# Altium schematic sheet EntradasAnalogicas.SchDoc
size A4; SheetNumber: 6; SheetTotal: 10
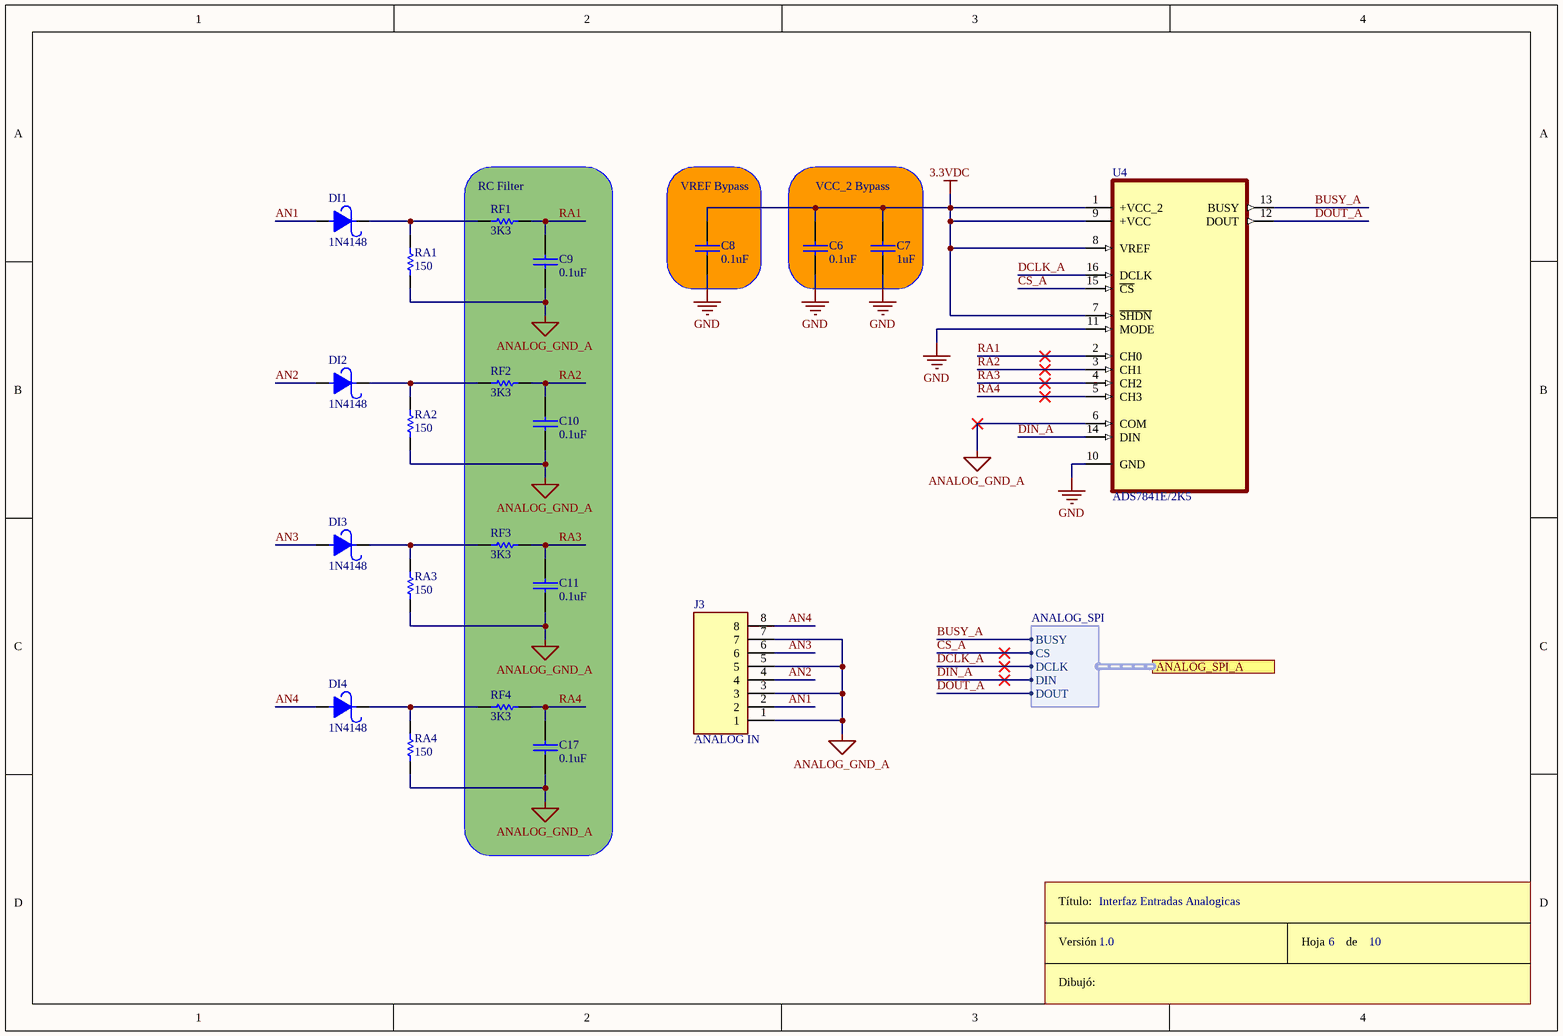
[diagram p0: EntradasAnalogicas.SchDoc]

## Parts
C6  0.1uF  [CAP100]
C7  1uF  [CAP200]
C8  0.1uF  [CAP100]
C9  0.1uF  [CAP100]
C10  0.1uF  [CAP100]
C11  0.1uF  [CAP100]
C17  0.1uF  [CAP100]
DI1  1N4148  [DO41]
DI2  1N4148  [DO41]
DI3  1N4148  [DO41]
DI4  1N4148  [DO41]
J3  ANALOG IN  [TE_1586863-8]
RA1  150  [RES300]
RA2  150  [RES300]
RA3  150  [RES300]
RA4  150  [RES300]
RF1  3K3  [RES300]
RF2  3K3  [RES300]
RF3  3K3  [RES300]
RF4  3K3  [RES300]
ROT4  Rótulo  (value not drawn)  (graphical)
U4  ADS7841E/2K5  [SOP63P600X175-16N]

## Blocks framed on the sheet
RC Filter: C9-C11 C17 RF1-RF4
VREF Bypass: C8
VCC_2 Bypass: C6 C7

## Ports
ANALOG_SPI_A (harness ANALOG_SPI)

## Harnesses
ANALOG_SPI: BUSY, CS, DCLK, DIN, DOUT

## Nets
3.3VDC: C6.1 C7.1 C8.1 U4.1(+VCC_2) U4.7(~{SHDN}) U4.8(VREF) U4.9(+VCC)
ANALOG_GND_A: C9.2 C10.2 C11.2 C17.2 J3.1 J3.3 J3.5 J3.7 RA1.1 RA2.1 RA3.1 RA4.1 U4.6(COM)
GND: C6.2 C7.2 C8.2 U4.10(GND) U4.11(MODE)
AN1: DI1.1 J3.2
AN2: DI2.1 J3.4
AN3: DI3.1 J3.6
AN4: DI4.1 J3.8
BUSY_A: U4.13(BUSY) ; port ANALOG_SPI_A.BUSY
CS_A: U4.15(~{CS}) ; port ANALOG_SPI_A.CS
DCLK_A: U4.16(DCLK) ; port ANALOG_SPI_A.DCLK
DIN_A: U4.14(DIN) ; port ANALOG_SPI_A.DIN
DOUT_A: U4.12(DOUT) ; port ANALOG_SPI_A.DOUT
RA1: C9.1 RF1.2 U4.2(CH0)
RA2: C10.1 RF2.2 U4.3(CH1)
RA3: C11.1 RF3.2 U4.4(CH2)
RA4: C17.1 RF4.2 U4.5(CH3)
NetDI1_2: DI1.2 RA1.2 RF1.1
NetDI2_2: DI2.2 RA2.2 RF2.1
NetDI3_2: DI3.2 RA3.2 RF3.1
NetDI4_2: DI4.2 RA4.2 RF4.1

## Notes on the sheet
- Interfaz Entradas Analogicas
- 1.0
- 6
- 10
- (in symbol Rótulo) Título:; Versión; Hoja       de; Dibujó:

## Library data of the parts
C6-C11 C17 = CAP
DI1-DI4 = DIODO SCHOTTKY
J3 = 1586863-8: Conn Power HDR 8 POS 4.2mm Solder RA Thru-Hole 8 Terminal 1 Port Tray; MF: TE Connectivity; EU_RoHS_Compliance: Compliant; SnapEDA_Link: https://www.snapeda.com/parts/1586863-8/TE%20Connectivity%20AMP%20Connectors/view-part/1404500/?ref=snap; Price: None; Package: None; Availability: Unavailable; MP: 1586863-8; TE_purchase_URL: https://www.te.com/usa-en/product-1586863-8.html?te_bu=Cor&te_type=disp&te_campaign=seda_glo_cor-seda-global-disp-prtnr-fy19-seda-model-bom-cta_sma-317_1&elqCampaignId=32493; Value: *
RA1-RA4 RF1-RF4 = RES
U4 = ADS7841E/2K5: ANALOG-TO-DIGITAL CONVERTER; Package: None; Price: None; Value: *; MP: ADS7841E/2K5; Availability: Unavailable